# Altium schematic sheet MOTORDEMO.SchDoc
size A2
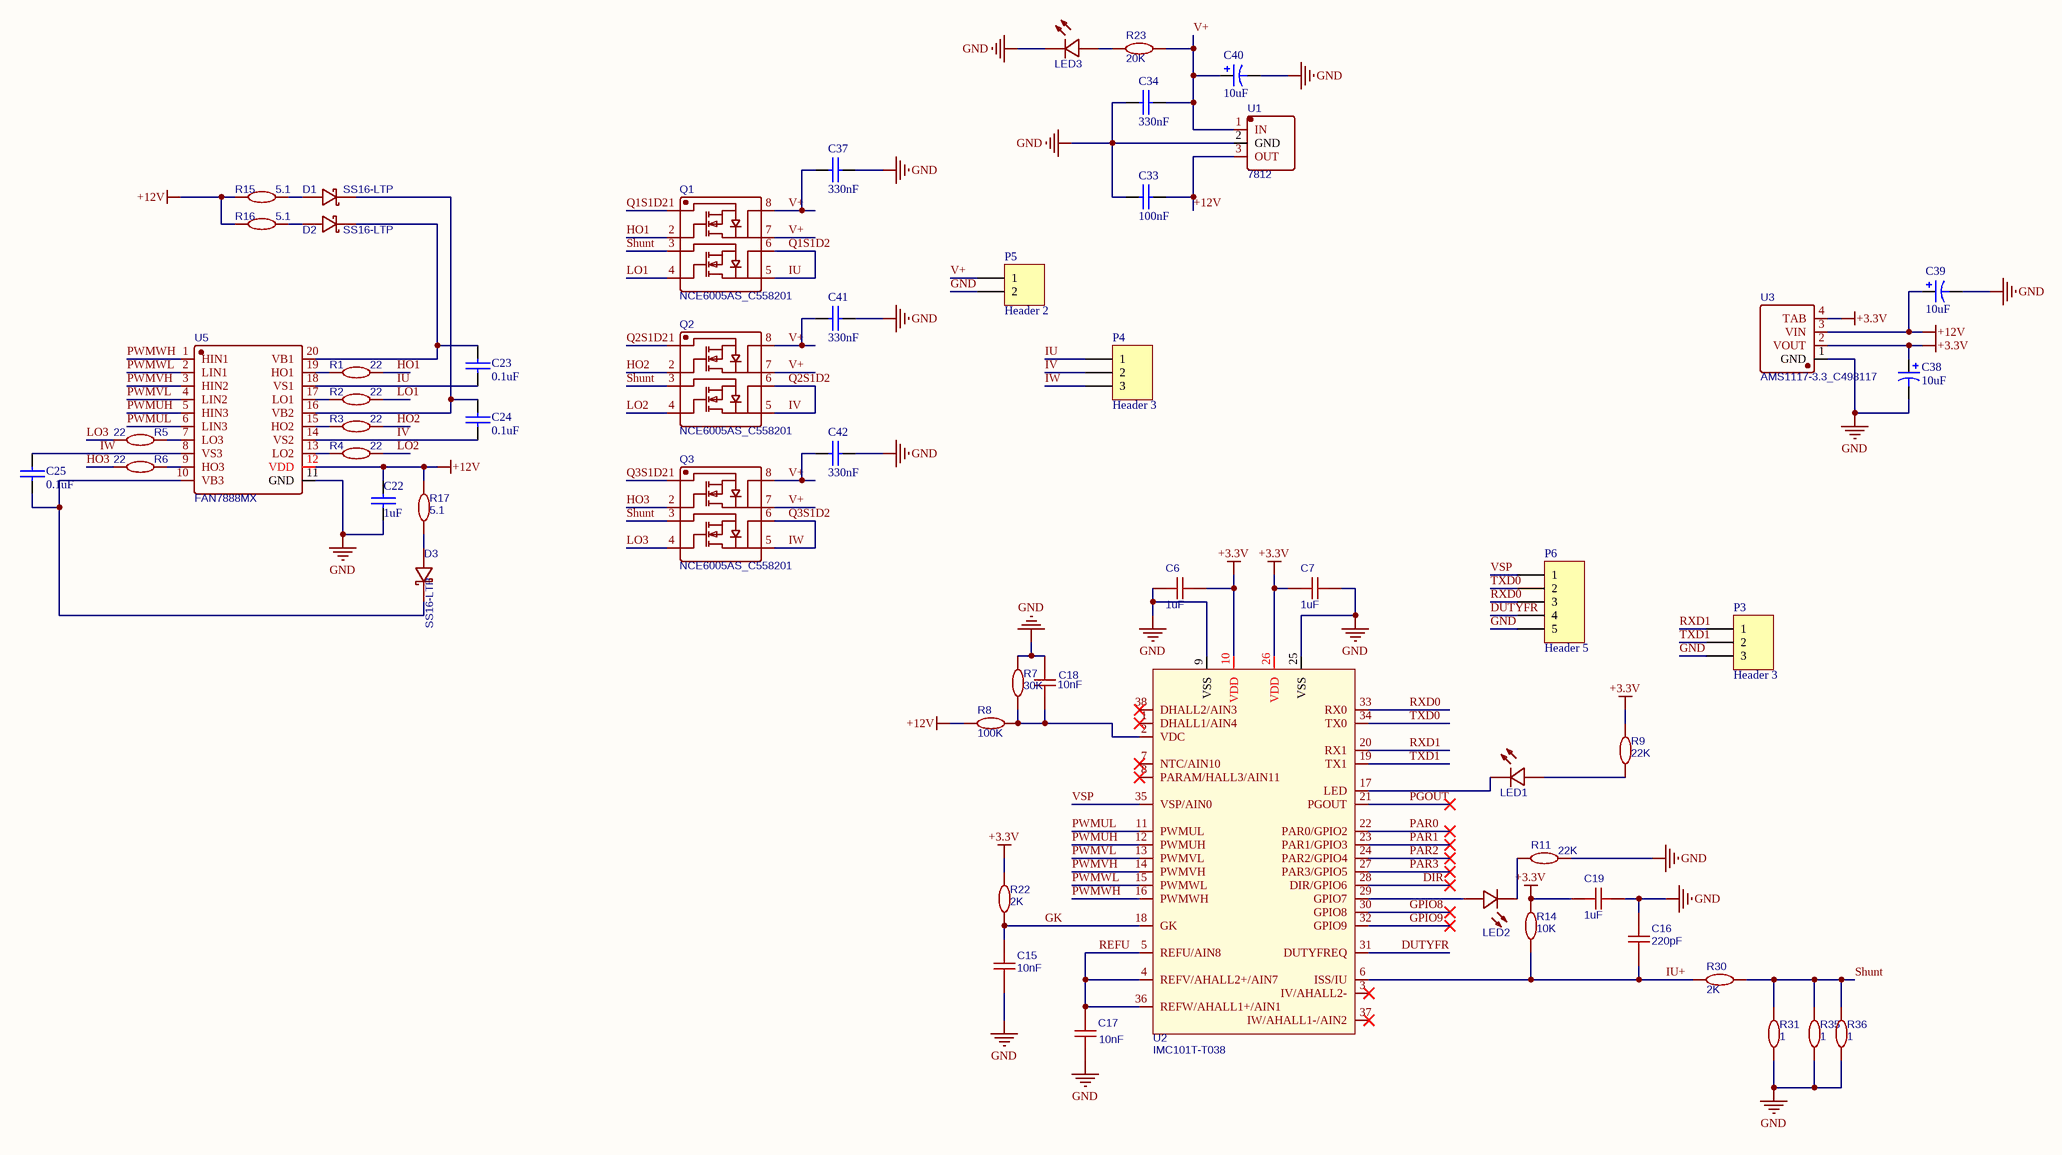
[diagram p0: MOTORDEMO.SchDoc]

## Parts
C6  1uF  [C0603]
C7  1uF  [C0603]
C15  10nF  [C0603]
C16  220pF  [C0603]
C17  10nF  [C0603]
C18  10nF  [C0603]
C19  1uF  [C0603]
C22  1uF  [C 0603_L]
C23  0.1uF  [C 0603_L]
C24  0.1uF  [C 0603_L]
C25  0.1uF  [C 0603_L]
C33  100nF  [C 0603_L]
C34  330nF  [C 0603_L]
C37  330nF  [C 0603_L]
C38  10uF  [10uF,35V,cap4*5.4]
C39  10uF  [10uF,35V,cap4*5.4]
C40  10uF  [10uF,35V,cap4*5.4]
C41  330nF  [C 0603_L]
C42  330nF  [C 0603_L]
D1  SS16-LTP  [LL-34_L3.5-W1.5-RD]
D2  SS16-LTP  [LL-34_L3.5-W1.5-RD]
D3  SS16-LTP  [LL-34_L3.5-W1.5-RD]
LED1  LED  [LED0603-R-RD]  (value not drawn)
LED2  LED  [LED0603-R-RD]  (value not drawn)
LED3  LED  [LED0603-R-RD]  (value not drawn)
P3  Header 3  [HDR1X3]
P4  Header 3  [HDR1X3]
P5  Header 2  [HDR1X2]
P6  Header 5  [HDR1X5]
Q1  NCE6005AS_C558201  [NCE6005AS]
Q2  NCE6005AS_C558201  [NCE6005AS]
Q3  NCE6005AS_C558201  [NCE6005AS]
R1  22  [R0603]
R2  22  [R0603]
R3  22  [R0603]
R4  22  [R0603]
R5  22  [R0603]
R6  22  [R0603]
R7  30K  [R0603]
R8  100K  [R0603]
R9  22K  [R0603]
R11  22K  [R0603]
R14  10K  [R0603]
R15  5.1  [R0603]
R16  5.1  [R0603]
R17  5.1  [R0603]
R22  2K  [R0603]
R23  20K  [R0603]
R30  2K  [R0603]
R31  1  [R1206]
R35  1  [R1206]
R36  1  [R1206]
U1  7812  [TO-220-3_L10.0-W4.5-P2.54-L]
U2  IMC101T-T038  [IMC101T-T038]
U3  AMS1117-3.3_C498117  [PG-SOT223-4_L6.5-W3.5-P2.30-LS7.0-BR]
U5  FAN7888MX  [FAN7888]

## Nets
+3.3V: C6.1 C7.2 C19.1 C38.1 R9.2 R14.1 R22.1 U2.10(VDD) U2.26(VDD) U3.2(VOUT) U3.4(TAB)
+12V: C22.2 C33.1 C39.1 R8.2 R15.2 R16.2 R17.1 U1.3(OUT) U3.3(VIN) U5.12(VDD)
GND: C6.2 C7.1 C15.1 C16.2 C17.1 C18.2 C19.2 C22.1 C33.2 C34.2 C37.1 C38.2 C39.2 C40.2 C41.1 C42.1 LED3.2 P3.3 P5.2 P6.5 R7.1 R11.1 R31.1 R35.1 R36.1 U1.2(GND) U2.9(VSS) U2.25(VSS) U3.1(GND) U5.11(GND)
DIR: U2.28(DIR/GPIO6)
DUTYFR: P6.4 U2.31(DUTYFREQ)
GK: C15.2 R22.2 U2.18(GK)
GPIO8: U2.30(GPIO8)
GPIO9: U2.32(GPIO9)
HO1: Q1.2 R1.1
HO2: Q2.2 R3.1
HO3: Q3.2 R6.2
IU: C23.1 P4.1 Q1.1 Q1.5 Q1.6 U5.18(VS1)  [also labelled Q1S1D2]
IU+: C16.1 R14.2 R30.1 U2.6(ISS/IU)
IV: C24.1 P4.2 Q2.1 Q2.5 Q2.6 U5.14(VS2)  [also labelled Q2S1D2]
IW: C25.2 P4.3 Q3.1 Q3.5 Q3.6 U5.8(VS3)  [also labelled Q3S1D2]
LO1: Q1.4 R2.1
LO2: Q2.4 R4.1
LO3: Q3.4 R5.2
PAR0: U2.22(PAR0/GPIO2)
PAR1: U2.23(PAR1/GPIO3)
PAR2: U2.24(PAR2/GPIO4)
PAR3: U2.27(PAR3/GPIO5)
PGOUT: U2.21(PGOUT)
PWMUH: U2.12(PWMUH) U5.5(HIN3)
PWMUL: U2.11(PWMUL) U5.6(LIN3)
PWMVH: U2.14(PWMVH) U5.3(HIN2)
PWMVL: U2.13(PWMVL) U5.4(LIN2)
PWMWH: U2.16(PWMWH) U5.1(HIN1)
PWMWL: U2.15(PWMWL) U5.2(LIN1)
REFU: C17.2 U2.4(REFV/AHALL2+/AIN7) U2.5(REFU/AIN8) U2.36(REFW/AHALL1+/AIN1)
RXD0: P6.3 U2.33(RX0)
RXD1: P3.1 U2.20(RX1)
Shunt: Q1.3 Q2.3 Q3.3 R30.2 R31.2 R35.2 R36.2
TXD0: P6.2 U2.34(TX0)
TXD1: P3.2 U2.19(TX1)
V+: C34.1 C37.2 C40.1 C41.2 C42.2 P5.1 Q1.7 Q1.8 Q2.7 Q2.8 Q3.7 Q3.8 R23.1 U1.1(IN)
VSP: P6.1 U2.35(VSP/AIN0)
NetC18_1: C18.1 R7.2 R8.1 U2.2(VDC)
NetC23_2: C23.2 D2.1(C) U5.20(VB1)
NetC24_2: C24.2 D1.1(C) U5.16(VB2)
NetC25_1: C25.1 D3.1(C) U5.10(VB3)
NetD1_2: D1.2(A) R15.1
NetD2_2: D2.2(A) R16.1
NetD3_2: D3.2(A) R17.2
NetLED1_1: LED1.1 R9.1
NetLED1_2: LED1.2 U2.17(LED)
NetLED2_1: LED2.1 U2.29(GPIO7)
NetLED2_2: LED2.2 R11.2
NetLED3_1: LED3.1 R23.2
NetR1_2: R1.2 U5.19(HO1)
NetR2_2: R2.2 U5.17(LO1)
NetR3_2: R3.2 U5.15(HO2)
NetR4_2: R4.2 U5.13(LO2)
NetR5_1: R5.1 U5.7(LO3)
NetR6_1: R6.1 U5.9(HO3)

Not connected (* = marked no-connect by the designer): U2 1(DHALL1/AIN4)* 3(IV/AHALL2-)* 7(NTC/AIN10)* 8(PARAM/HALL3/AIN11)* 37(IW/AHALL1-/AIN2)* 38(DHALL2/AIN3)*

## Library data of the parts
C6 C7 C15-C19 = 100nF: BOM_Manufacturer: SAMSUNG; BOM_Manufacturer Part: CL10B104KC8NNNC; nameAlias: Capacitance; BOM_Supplier: LCSC; BOM_Supplier Part: C15725; BOM_JLCPCB Part Class: Extended Part; spicePre: C; spiceSymbolName: CL10B104KC8NNNC
C22-C25 C33 C34 C37 C41 C42 = CAP: Capacitor
C38-C40 = Cap Pol3: Polarized Capacitor (Surface Mount); Value: 100uF; Published: 8-Jun-2000; LatestRevisionDate: 29-May-2009; LatestRevisionNote: IPC-7351 Footprint Added.; PackageReference: C0805; Publisher: Altium Limited; PackageDescription: Chip Capacitor
D1-D3 = SS16-LTP: BOM_Manufacturer: MCC; BOM_Supplier: LCSC; BOM_Manufacturer Part: SS16-LTP; BOM_Supplier Part: C85689; BOM_JLCPCB Part Class: Extended Part; spicePre: D; spiceSymbolName: SS16-LTP
LED1-LED3 = LED: BOM_Manufacturer: Everlight Elec; BOM_Manufacturer Part: 19-213/R6W-BP2Q2B/3T; Contributor: LCSC; BOM_Supplier: LCSC; BOM_Supplier Part: C181863; BOM_JLCPCB Part Class: Extended Part; spicePre: L; spiceSymbolName: 19-213/R6W-BP2Q2B/3T
P3 P4 = Header 3: Header, 3-Pin; LatestRevisionDate: 17-Jul-2002; LatestRevisionNote: Re-released for DXP Platform.; Publisher: Altium Limited
P5 = Header 2: Header, 2-Pin; LatestRevisionDate: 17-Jul-2002; LatestRevisionNote: Re-released for DXP Platform.; Publisher: Altium Limited
P6 = Header 5: Header, 5-Pin; LatestRevisionDate: 17-Jul-2002; LatestRevisionNote: Re-released for DXP Platform.; Publisher: Altium Limited
Q1-Q3 = NCE6005AS_C558201: BOM_Manufacturer: VBsemi Elec; Contributor: LCSC; BOM_Supplier: LCSC; BOM_Supplier Part: C558201; BOM_Manufacturer Part: NCE6005AS; BOM_JLCPCB Part Class: Extended Part; spicePre: Q; spiceSymbolName: NCE6005AS_C558201
R1-R9 R11 R14-R17 R22 R23 R30 R31 R35 R36 = 1M: BOM_Manufacturer: Huaxin S&T; BOM_Manufacturer Part: MR06X105JTL; nameAlias: Resistance (Ohms); Contributor: LCSC; BOM_Supplier: LCSC; BOM_Supplier Part: C327832; spicePre: R; spiceSymbolName: MR06X105JTL
U1 = 7812: BOM_Manufacturer: Foshan Blue Rocket Elec; Contributor: LCSC; BOM_Supplier: LCSC; BOM_Supplier Part: C358369; BOM_Manufacturer Part: 7812; BOM_JLCPCB Part Class: Extended Part; spicePre: U; spiceSymbolName: 7812
U2 = IMC101T-T038: BOM_Manufacturer: Infineon Technologies; Contributor: LCSC; BOM_Supplier: LCSC; BOM_Supplier Part: C536267; BOM_Manufacturer Part: IMC101T-T038; BOM_JLCPCB Part Class: Extended Part; spicePre: U; spiceSymbolName: IMC101T-T038
U3 = AMS1117-3.3_C498117: BOM_Manufacturer: HGC(Huaguan Semicon); Contributor: LCSC; BOM_Supplier: LCSC; BOM_Supplier Part: C498117; BOM_Manufacturer Part: AMS1117-3.3; spicePre: U; spiceSymbolName: AMS1117-3.3_C498117
U5 = FAN7888MX: BOM_Manufacturer: ON Semicon; Contributor: LCSC; BOM_Supplier: LCSC; BOM_Supplier Part: C258167; BOM_Manufacturer Part: FAN7888MX; BOM_JLCPCB Part Class: Extended Part; spicePre: U; spiceSymbolName: FAN7888MX